# EAGLE design spice-usbm (EAGLE 9.3.0)
CREVISION: hv0a; DESIGNER: Rafael Silva
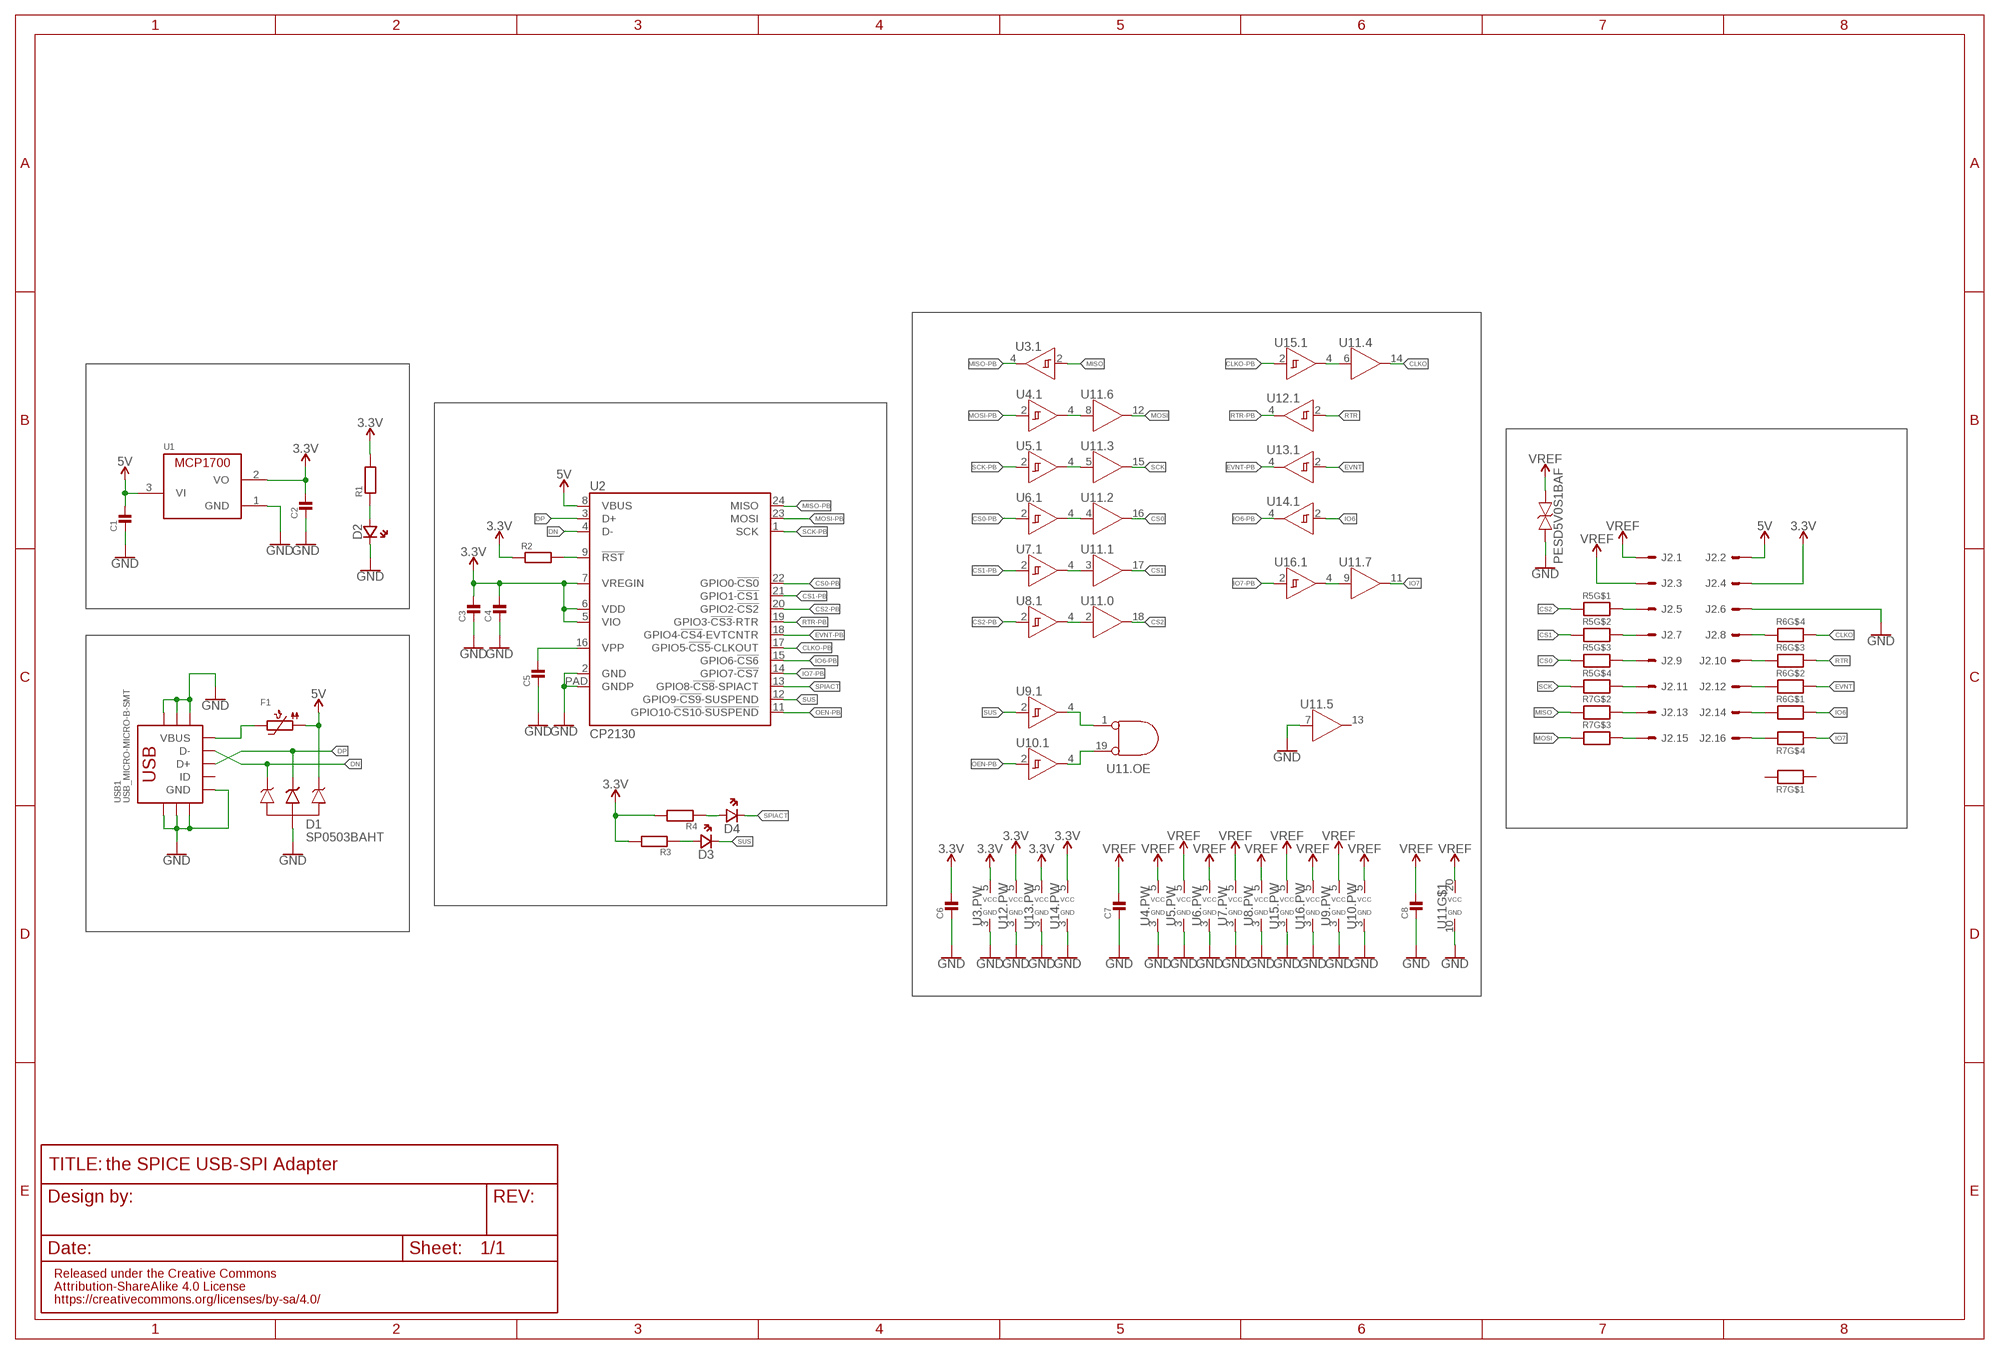
[diagram p0: schematic, sheet 1]

## Parts
C1  MLCC0603  [0603_WAVE]
C2  MLCC0603  [0603_WAVE]
C3  MLCC0603  [0603_WAVE]
C4  MLCC0603  [0603_WAVE]
C5  MLCC0603  [0603_WAVE]
C6  MLCC0603  [0603_WAVE]
C7  MLCC0603  [0603_WAVE]
C8  MLCC0603  [0603_WAVE]
D1  SP0503BAHT  [SOT143]
D2  LED0603  [CHIPLED_0603]
D3  LED0603  [CHIPLED_0603]
D4  LED0603  [CHIPLED_0603]
D5  PESD5V0S1BAF  [SOD323]
F1  PTC1210  [PTC1210]
J2  2X8  [2X8_2.54]
R1  RESISTOR0603  [0603_WAVE]
R2  RESISTOR0603  [0603_WAVE]
R3  RESISTOR0603  [0603_WAVE]
R4  RESISTOR0603  [0603_WAVE]
R5  RESISTOR_4PACK  [RESPACK_4X0603]
R6  RESISTOR_4PACK  [RESPACK_4X0603]
R7  RESISTOR_4PACK  [RESPACK_4X0603]
U1  MCP1700T-3302TT  [SOT-23]
U2  CP2130  [QFN24]
U3  74LVC1G17  [SC70-5]
U4  74LVC1G17  [SC70-5]
U5  74LVC1G17  [SC70-5]
U6  74LVC1G17  [SC70-5]
U7  74LVC1G17  [SC70-5]
U8  74LVC1G17  [SC70-5]
U9  74LVC1G17  [SC70-5]
U10  74LVC1G17  [SC70-5]
U11  74HC541  [TSSOP20]
U12  74LVC1G17  [SC70-5]
U13  74LVC1G17  [SC70-5]
U14  74LVC1G17  [SC70-5]
U15  74LVC1G17  [SC70-5]
U16  74LVC1G17  [SC70-5]
USB1  USB_MICRO-MICRO-B-SMT  [USB-MICRO-SMD]

## Nets
3.3V: C2.P$1 C3.P$1 C4.P$1 C6.P$1 J2.4 R1.P$2 R2.P$1 R3.P$2 R4.P$2 U1.2(VO) U2.5(VIO) U2.6(VDD) U2.7(VREGIN) U3.5(.PW:VCC) U12.5(.PW:VCC) U13.5(.PW:VCC) U14.5(.PW:VCC)
5V: C1.P$1 D1.4 F1.P$1 J2.2 U1.3(VI) U2.8(VBUS)
CLKO: R6.5 U11.14(.4:Y)
CLKO-PB: U2.17(GPIO5-!CS5!-CLKOUT) U15.2(.1:A)
CS0: R5.3 U11.16(.2:Y)
CS0-PB: U2.22(GPIO0-!CS0) U6.2(.1:A)
CS1: R5.2 U11.17(.1:Y)
CS1-PB: U2.21(GPIO1-!CS1) U7.2(.1:A)
CS2: R5.1 U11.18(.0:Y)
CS2-PB: U2.20(GPIO2-!CS2) U8.2(.1:A)
DN: D1.2 U2.4(D-) USB1.D-
DP: D1.3 U2.3(D+) USB1.D+
EVNT: R6.7 U13.2(.1:A)
EVNT-PB: U2.18(GPIO4-!CS4!-EVTCNTR) U13.4(.1:Y)
GND: C1.P$2 C2.P$2 C3.P$2 C4.P$2 C5.P$2 C6.P$2 C7.P$2 C8.P$2 D1.1 D2.C(CA) D5.P$2 J2.6 U1.1(GND) U2.2(GND) U2.PAD(GNDP) U3.3(.PW:GND) U4.3(.PW:GND) U5.3(.PW:GND) U6.3(.PW:GND) U7.3(.PW:GND) U8.3(.PW:GND) U9.3(.PW:GND) U10.3(.PW:GND) U11.7(.5:A) U11.10(GND) U12.3(.PW:GND) U13.3(.PW:GND) U14.3(.PW:GND) U15.3(.PW:GND) U16.3(.PW:GND) USB1.GND USB1.SHIELD1(SHIELD) USB1.SHIELD2(SHIELD) USB1.SHIELD3(SHIELD) USB1.SHIELD4(SHIELD) USB1.SHIELD5(SHIELD) USB1.SHIELD6(SHIELD)
IO6: R6.8 U14.2(.1:A)
IO6-PB: U2.15(GPIO6-!CS6) U14.4(.1:Y)
IO7: R7.4 U11.11(.7:Y)
IO7-PB: U2.14(GPIO7-!CS7) U16.2(.1:A)
MISO: R7.2 U3.2(.1:A)
MISO-PB: U2.24(MISO) U3.4(.1:Y)
MOSI: R7.3 U11.12(.6:Y)
MOSI-PB: U2.23(MOSI) U4.2(.1:A)
N$1: U11.6(.4:A) U15.4(.1:Y)
N$2: D3.A(AN) R3.P$1
N$3: D4.A(AN) R4.P$1
N$4: R2.P$2 U2.9(!RST)
N$5: U5.4(.1:Y) U11.5(.3:A)
N$6: J2.13 R7.7
N$7: U4.4(.1:Y) U11.8(.6:A)
N$8: C5.P$1 U2.16(VPP)
N$9: D2.A(AN) R1.P$1
N$10: U6.4(.1:Y) U11.4(.2:A)
N$11: U7.4(.1:Y) U11.3(.1:A)
N$12: U8.4(.1:Y) U11.2(.0:A)
N$13: F1.P$2 USB1.VBUS
N$14: U11.9(.7:A) U16.4(.1:Y)
N$16: J2.15 R7.6
N$17: J2.5 R5.8
N$18: J2.7 R5.7
N$19: J2.9 R5.6
N$20: J2.11 R5.5
N$21: J2.8 R6.4
N$22: J2.10 R6.3
N$23: J2.12 R6.2
N$24: J2.14 R6.1
N$25: J2.16 R7.5
OE1: U9.4(.1:Y) U11.1(.OE:A)
OE2: U10.4(.1:Y) U11.19(.OE:B)
OEN-PB: U2.11(GPIO10-!CS10!-!SUSPEND) U10.2(.1:A)
RTR: R6.6 U12.2(.1:A)
RTR-PB: U2.19(GPIO3-!CS3!-RTR) U12.4(.1:Y)
SCK: R5.4 U11.15(.3:Y)
SCK-PB: U2.1(SCK) U5.2(.1:A)
SPIACT: D4.C(CA) U2.13(GPIO8-!CS8!-SPIACT)
SUS: D3.C(CA) U2.12(GPIO9-!CS9!-SUSPEND) U9.2(.1:A)
VREF: C7.P$1 C8.P$1 D5.P$1 J2.1 J2.3 U4.5(.PW:VCC) U5.5(.PW:VCC) U6.5(.PW:VCC) U7.5(.PW:VCC) U8.5(.PW:VCC) U9.5(.PW:VCC) U10.5(.PW:VCC) U11.20(VCC) U15.5(.PW:VCC) U16.5(.PW:VCC)
Unconnected: R7.1 R7.8 U11.13(.5:Y) USB1.ID

## Notes on the sheet
- the SPICE USB-SPI Adapter

## Library data of the parts
C1-C8 = Passive Components > Capacitors > Multilayer Ceramic Capacitors MLCC:MLCC: KEMET’s X7R dielectric features a 125°C maximum operating temperature and is considered temperature stable. The Electronics Components, Assemblies and Materials Association (EIA) characterizes X7R dielectric as a Class II material. Components of this classification are fixed, ceramic dielectric capacitors suited for bypass and decoupling applications or for frequency discriminating circuits where Q and stability of capacitance characteristics are not critical. X7R exhibits a predictable change in capacitance with respect to time and voltage, boasting a minimal change in capacitance with reference to ambient temperature. Capacitance change is limited to ±15% from −55°C to +125°C.
D1 = Circuit Protection > ESD Suppressors \ TVS Diodes:SP0503BAHT
D2-D4 = Opto-electronics > LED Emitters:LED: LED 0603 - 0603 Surface Mount Package 2mA: Green LED - Low Power (3.9mcd, 2ma, 1.7Vf) - Digikey: 475-2709-2-ND Orange LED - Low Power (9.8mcd, 2ma, 1.8Vf) - Digikey: 475-1194-2-ND Red LED - Low Power (5mcd, 2ma, 1.8Vf) - Digikey: 475-1195-2-ND Yellow LED - Low Power (7mcd, 2ma, 1.8Vf) - Digikey: 475-1196-2-ND 5mA: Blue LED - Low Power (17mcd, 5ma, 2.9Vf) - Digikey: LNJ937W8CRACT-ND 0805 - 0805 Surface Mount Package 2mA: Red LED (8.8mcd, 2mA, 1.8Vf, Clear) - Low Power [Digikey: 475-2510-1-ND] Green LED (5mcd, 2mA, 1.8Vf, Clear) - Low Power [Digikey: 475-2730-1-ND] Yellow LED (11.3mcd, 2mA, 1.8Vf, Clear) - Low Power [Digikey: 475-2555-1-ND] 20mA: Red LED (104mcd, 20mA, Diffused) - LS R976 [Digikey: 475-1278-6-ND] Red LED (12mcd, 20mA, 2.0Vf, Clear) - APT2012EC [Digikey: 754-1128-1-ND] Green LED (15mcd, 20mA, 2.2Vf, Clear) - APT2012GC [Digikey: 754-1131-1-ND] Orange LED (160mcd, 20mA, 2.1Vf, Clear) - APT2012SECK [Digikey: 754-1130-1-ND] 1206 - 1206 Surface Mount Package Green LED (26mcd, 20mA, Diffused) - LG N971 [Digikey: 475-1407-6-ND] Red LED (15mcd, 20mA, Diffused) - LH N974 [Digikey: 475-1416-6-ND] Cree - Cree High-Power Surface Mount LEDs XPEBWT-L1-0000-00D50 - White 111lm 350mA 2.9Vf 6200K 110° XTEAWT-00-0000-00000LEE3 - White 114lm 350mA 2.85Vf 5000K 115° Everlight - Everlight 45-21 Series Surface Mount LEDs 45-21/QK2C-B2832AC2CB2/2T - Warm White 2000mcd 20mA 3.25Vf 3050K 120° 45-21/LK2C-B38452C4CB2/2T - Nuetral White 2000mcd 20mA 3.25Vf 4150K 120° 45-21/LK2C-B50634C6CB2/2T - Cold White 2200mcd 20mA 3.25Vf 5650K 120° PLCC2 Reverse Mount LS T77K-J1L2-1-0-2-R18-Z - Red 11.25mcd 2mA 1.8Vf 630nm 120° LO T77K-L1M2-24-Z - Orange 19.6mcd 2mA 1.8Vf 606nm 120° LY T77K-K2M1-26-Z - Yellow 15.7mcd 2mA 1.8Vf 587nm 120°
D5 = Circuit Protection > ESD Suppressors \ TVS Diodes:PESD5V0S1BAF: Low capacitance bidirectional ElectroStatic Discharge (ESD) protection diode designed to protect one signal line from the damage caused by ESD and other transients.
F1 = Circuit Protection > Resettable Fuses - PPTC:PTC
J2 = Connectors > Header:2X8
R1-R4 = Passive Components > Resistors > Chip Resistors:RESISTOR: Resistors For new designs, use the packages preceded by an '_' character since they are more reliable: The following footprints should be used on most boards: _0402 - Standard footprint for regular board layouts _0603 - Standard footprint for regular board layouts _0805 - Standard footprint for regular board layouts _1206 - Standard footprint for regular board layouts For extremely tight-pitch boards where space is at a premium, the following 'micro-pitch' footprints can be used (smaller pads, no silkscreen outline, etc.): _0402MP - Micro-pitch footprint for very dense/compact boards _0603MP - Micro-pitch footprint for very dense/compact boards _0805MP - Micro-pitch footprint for very dense/compact boards _1206MP - Micro-pitch footprint for very dense/compact boards
R5-R7 = Passive Components > Resistors > Resistor Networks & Arrays:RESISTOR_4PACK: Resistor Packs (4 resistors) 4 x 0603 10K 1/16W - Digikey: YC164J-10KCT-ND
U1 = Power > LDO Voltage Regulators:MCP1700
U2 = Semiconductors > Integrated Circuits - ICs > Interface ICs > USB Interface IC:CP2130: SINGLE-CHIP USB-TO-SPI BRIDGE
U3-U10 U12-U16 = Semiconductors > Integrated Circuits - ICs > Logic ICs > Logic Gates:74LVC1G17
U11 = Semiconductors > Integrated Circuits - ICs > Logic ICs > Logic Gates:74HC541
USB1 = Connectors > USB:USB_MICRO

## Board
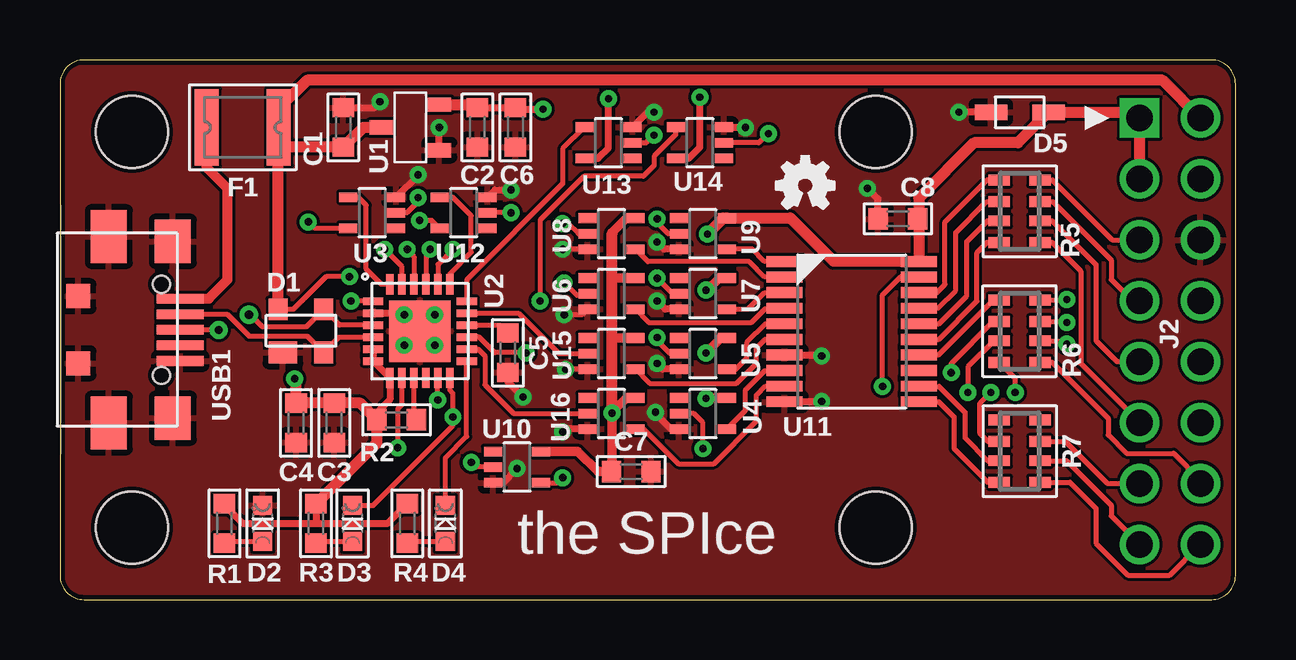
[diagram p1: board, top side]
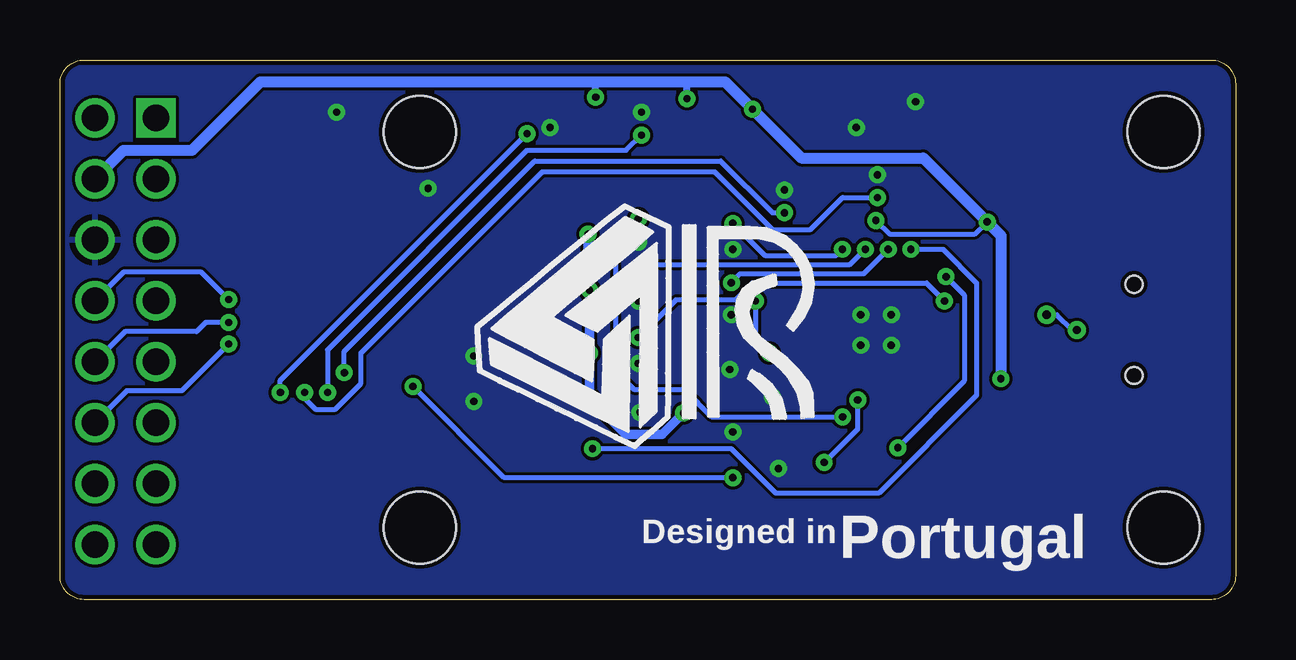
[diagram p2: board, bottom side, seen from below]

Size 49 x 22.5 mm. Coordinates in mm from the lower left corner, seen from the top.
Outline: 0,21.5 0,1 arc90 1,0 48,0 arc90 49,1 49,21.5 arc90 48,22.5 1,22.5 arc90 0,21.5
Copper layers (1*16): Top 0.035mm / dielectric 1.6mm / Bottom 0.035mm
Design rules "jlcpcb-dr": minimum track width 5mil, minimum drill 0.3mm, track to track 5mil, track to pad 5mil, pad to pad 5mil, via to via 5mil, smd to smd 5mil, copper to edge 0.2mm, drill to drill 5mil, minimum pad ring 10mil, minimum via ring 8mil, stop-mask expansion 4mil, vias tented up to drill 0.7mm, thermal gap 10mil
Holes 3 mm at 3,19.5 3,3 34,19.5 34,3

### Footprints (pad centres in the part's own frame; a part is rotated, then mirrored left to right if it is on the bottom)
0603_WAVE = smd 0.8 x 0.9: P$1 -0.823,0; P$2 0.823,0
SOT143 = smd 1.2 x 0.9: 1 -0.711,-0.889 | smd 0.8 x 0.9: 2 0.989,-0.889; 3 0.989,0.911; 4 -0.911,0.911
CHIPLED_0603 = smd 0.8 x 0.8: A 0,-0.75; C 0,0.75
SOD323 = smd 1.35 x 0.65: P$1 -1.2,0; P$2 1.2,0
PTC1210 = smd 1 x 3.2: P$1 -1.5,0; P$2 1.5,0
2X8_2.54 = drill 1.1 square: 1 -8.89,-1.27 | drill 1.1: 2 -8.89,1.27; 3 -6.35,-1.27; 4 -6.35,1.27; 5 -3.81,-1.27; 6 -3.81,1.27; 7 -1.27,-1.27; 8 -1.27,1.27; 9 1.27,-1.27; 10 1.27,1.27; 11 3.81,-1.27; 12 3.81,1.27; 13 6.35,-1.27; 14 6.35,1.27; 15 8.89,-1.27; 16 8.89,1.27
RESPACK_4X0603 = smd 0.45 x 0.9: 1 -1.3,-0.85; 2 -0.4,-0.85; 3 0.4,-0.85; 4 1.3,-0.85; 5 1.3,0.85; 6 0.4,0.85; 7 -0.4,0.85; 8 -1.3,0.85
SOT-23 = smd 0.6 x 1: 1 -0.95,-1.2; 2 0.95,-1.2; 3 0,1.2
QFN24 = smd 0.3 x 0.85: 1 -1.25,-1.95; 2 -0.75,-1.95; 3 -0.25,-1.95; 4 0.25,-1.95; 5 0.75,-1.95; 6 1.25,-1.95; 13 1.25,1.95; 14 0.75,1.95; 15 0.25,1.95; 16 -0.25,1.95; 17 -0.75,1.95; 18 -1.25,1.95 | smd 0.85 x 0.3: 7 1.95,-1.25; 8 1.95,-0.75; 9 1.95,-0.25; 10 1.95,0.25; 11 1.95,0.75; 12 1.95,1.25; 19 -1.95,1.25; 20 -1.95,0.75; 21 -1.95,0.25; 22 -1.95,-0.25; 23 -1.95,-0.75; 24 -1.95,-1.25 | smd 2.55 x 2.55: PAD 0,0
SC70-5 = smd 0.4 x 0.75: 1 -0.65,-1; 2 0,-1; 3 0.65,-1; 4 0.65,1; 5 -0.65,1
TSSOP20 = smd 0.45 x 1.5: 1 -2.91,-2.8; 2 -2.26,-2.8; 3 -1.61,-2.8; 4 -0.96,-2.8; 5 -0.31,-2.8; 6 0.34,-2.8; 7 0.99,-2.8; 8 1.64,-2.8; 9 2.29,-2.8; 10 2.94,-2.8; 11 2.94,2.8; 12 2.29,2.8; 13 1.64,2.8; 14 0.99,2.8; 15 0.34,2.8; 16 -0.31,2.796; 17 -0.96,2.796; 18 -1.61,2.8; 19 -2.26,2.8; 20 -2.91,2.8
USB-MICRO-SMD = smd 1.95 x 0.4: D+ 2.975,0; D- 2.975,0.65; GND 2.975,-1.3; ID 2.975,-0.65; VBUS 2.975,1.3 | smd 1.5 x 2.2: SHIELD1 0,3.885; SHIELD2 0,-3.885 | smd 1.5 x 1.8: SHIELD3 2.667,3.685; SHIELD4 2.667,-3.685 | smd 1 x 1: SHIELD5 -1.27,1.4; SHIELD6 -1.27,-1.4 | hole 0.7: 2.2,1.9; 2.2,-1.9

### Placement (x,y rotation side)
C1  11.81,19.68 90 top
C2  17.4,19.68 270 top
C3  11.43,7.37 270 top
C4  9.84,7.37 270 top
C5  18.67,10.29 270 top
C6  18.99,19.68 270 top
C7  23.81,5.33 0 top
C8  34.92,15.88 180 top
D1  10,11.19 0 top
D2  8.45,3.17 0 top
D3  12.19,3.17 0 top
D4  16.07,3.17 0 top
D5  40.01,20.32 180 top
F1  7.62,19.68 180 top
J2  46.27,11.19 270 top
R1  6.86,3.17 90 top
R2  14.03,7.49 0 top
R3  10.67,3.17 90 top
R4  14.48,3.17 90 top
R5  40,16.19 270 top
R6  40,11.19 90 top
R7  40,6.19 270 top
U1  14.61,19.68 90 top
U2  15,11.19 270 top
U3  13.02,16.13 90 top
U4  26.8,7.76 270 top
U5  26.8,10.26 270 top
U6  22.99,12.76 270 top
U7  26.8,12.76 270 top
U8  22.99,15.26 270 top
U9  26.8,15.26 270 top
U10  19.05,5.52 270 top
U11  33,11.19 270 top
U12  16.83,16.13 90 top
U13  22.86,19.05 90 top
U14  26.67,19.05 90 top
U15  22.99,10.26 270 top
U16  22.99,7.76 270 top
U$1  [DESIGNEDINPT]  17.16,1.72 0 bottom
U$2  [OSHW-LOGO-MINI]  31.06,17.27 0 top
U$4  [RAFAEL_SILVA_10MM_ALT]  31.6,6.4 0 bottom
USB1  2.03,11.25 0 top

### Tracks (layer width: path | path; a pad name or v marks a point on that pad's centre or on a via)
3.3V  (via drill 0.3 pad 0.6)
  Top 0.2: R1.P$2 6.86,3.94 | 17.27,20.64 C2.P$1 | U3.5 10.62,15.48 v10.35,15.75 | U12.5 15.49,15.81 v14.99,15.81
  Top 0.3: 6.86,3.94 7.62,3.17 10.67,3.17 | 10.67,3.17 13.65,3.17 R4.P$2 | R3.P$2 10.67,3.17 | R2.P$1 13.21,7.81 13.75,8.35 U2.7 U2.6 U2.5 | U13.5 22.43,18.4 22.86,18.83 v22.86,20.89 | U14.5 26.21,18.4 26.67,18.86 v26.67,20.95 | C2.P$1 C6.P$1 19.05,20.45 v20.13,20.45
  Top 0.45: R3.P$2 13.21,6.54 R2.P$1 12.51,8.19 C3.P$1 C4.P$1 9.84,9.14 v9.78,9.21 | U1.2 17.27,20.64
  Bottom 0.2: v14.99,15.81 14.41,15.24 10.86,15.24 v10.35,15.75
  Bottom 0.3: v22.86,20.89 22.86,21.59 | v26.67,20.95 26.67,21.59
  Bottom 0.45: v9.78,9.21 9.78,15.18 v10.35,15.75 13.02,18.41 18.1,18.41 v20.13,20.45 21.27,21.59 22.86,21.59 26.67,21.59 40.64,21.59 43.5,18.73 46.35,18.73 J2.4
5V  (via drill 0.3 pad 0.6)
  Top 0.2: U2.8 14.25,8.13 14.08,7.96 v14.08,6.33 | v12.06,13.46 11.09,13.46 9.72,12.1 D1.4 | 9.09,19.65 F1.P$1
  Top 0.45: U1.3 12.63,19.68 C1.P$1 | J2.2 45.97,21.65 10.29,21.65 9.12,20.48 F1.P$1 9.12,19.28 8.89,19.05 9.08,18.86 C1.P$1 | 11.75,18.86 C1.P$1 | D1.4 9.09,19.65
  Bottom 0.2: v14.08,6.33 11.3,9.11 11.3,12.7 v12.06,13.46
CLKO
  Top 0.2: U11.14 36.62,10.2 38.91,12.49 R6.5
CLKO-PB
  Top 0.2: U2.17 19.11,11.94 20.79,10.26 U15.2
CS0
  Top 0.2: U11.16 36.63,11.5 37.79,12.66 37.79,14.93 38.65,15.79 R5.3
CS0-PB  (via drill 0.3 pad 0.6)
  Top 0.2: U6.2 21.92,12.69 21.53,12.69 v21.02,13.21 | v14.48,14.61 14.48,14.57 14.75,14.3 U2.22
  Bottom 0.2: v21.02,13.21 20.64,13.59 15.49,13.59 v14.48,14.61
CS1
  Top 0.2: U11.17 36.6,12.15 37.34,12.89 37.34,15.3 38.62,16.59 R5.2
CS1-PB  (via drill 0.3 pad 0.6)
  Top 0.2: U7.2 25.53,12.76 v24.89,13.4 | v15.43,14.61 15.25,14.43 U2.21
  Bottom 0.2: v24.89,13.4 24.32,13.97 16.07,13.97 v15.43,14.61
CS2
  Top 0.2: U11.18 36.55,12.8 36.89,13.14 36.89,15.75 38.64,17.49 R5.1
CS2-PB  (via drill 0.3 pad 0.6)
  Top 0.2: U8.2 21.61,15.26 21.18,15.68 v20.95,15.68 | v16.38,14.61 15.75,13.97 U2.20
  Bottom 0.2: v20.95,15.68 19.62,14.35 16.64,14.35 v16.38,14.61
DN
  Top 0.2: U2.4 11.63,10.94 D1.2 10.3,10.99 8.51,10.99 7.88,10.99 6.96,11.9 USB1.D-
DP  (via drill 0.35)
  Top 0.152: 7.94,11.87 v7.87,11.87 | v6.61,11.24 v6.6,11.25
  Top 0.2: U2.3 11.65,11.44 D1.3 10.26,11.37 8.45,11.37 7.94,11.87 | v6.6,11.25 USB1.D+
  Bottom 0.2: v7.87,11.87 7.44,11.87 6.8,11.24 v6.61,11.24
EVNT  (via drill 0.3 pad 0.6)
  Top 0.2: R6.7 38.92,10.79 37.85,9.72 v37.85,8.64 | v24.77,19.37 24.75,19.37 24.43,19.05 U13.2
  Bottom 0.2: v24.77,19.37 25.4,18.73 29.53,18.73 37.85,10.41 v37.85,8.64
EVNT-PB
  Top 0.2: U13.4 20.95,18.8 20.95,17.34 16.95,13.33 U2.18
GND  (via drill 0.3 pad 0.6)
  Top 0.2: U8.3 v20.96,14.61 v20.95,14.61 | U6.3 21.75,11.87 v21.02,11.87 | U15.3 21.08,9.61 v21.08,9.59
  Top 0.3: U2.2 14.29,11.94 v14.35,11.87 14.35,11.84 U2.PAD | C5.P$2 18.67,9.08 v19.3,8.45 | U5.3 25.13,9.61 v24.89,9.84 | U7.3 25.23,12.11 v24.89,12.45 | U9.3 25.18,14.61 v24.88,14.91 | U14.3 28.56,19.7 v28.57,19.68 | U13.3 24.48,20.32 v24.77,20.32 | U4.3 25.78,7.09 25.5,7.09 24.83,7.76 v24.83,7.81 | U10.3 18.46,4.88 v19.05,5.46 | 15.59,10.6 v15.62,10.6 | 14.41,10.6 v14.35,10.6 | C1.P$2 13.08,20.51 v13.34,20.77 | U1.1 v15.8,19.68 v15.81,19.68 | U12.3 18.13,17.08 v18.8,17.08 | U3.3 14.92,17.68 v14.92,17.71 | U16.3 21.08,7.11 v20.95,6.99 | U11.10 v31.75,8.26 | U11.7 31.71,10.2 v31.75,10.16 | D5.P$2 v37.47,20.32 | C8.P$2 34.1,16.7 v33.66,17.14
  other vias: 15.62,11.87
  pour Bottom: 0,22.54 48.96,22.54 48.96,0 0,0
  pour Top: 48.96,0 0,0 0,22.54 48.96,22.54
IO6  (via drill 0.3 pad 0.6)
  Top 0.2: 39.04,9.89 R6.8 39.81,9.23 v39.81,8.64 | v29.53,19.43 29.51,19.43 29.13,19.05 U14.2
  Bottom 0.2: v39.81,8.64 39.81,9.14 v29.53,19.43
IO6-PB  (via drill 0.3 pad 0.6)
  Top 0.2: U14.4 25.66,19.38 24.77,18.48 24.77,18.1 24.32,17.65 21.84,17.65 20.01,15.82 v20.01,12.45 | v19.43,10.29 18.12,10.29 17.48,10.94 U2.15
  Bottom 0.2: v20.01,12.45 20.01,10.87 v19.43,10.29
IO7
  Top 0.2: U11.11 36.63,8.25 37.26,7.62 37.26,6.3 38.67,4.89 R7.4
IO7-PB
  Top 0.2: U2.14 17.44,10.44 17.72,10.16 17.72,8.95 18.91,7.76 U16.2
MISO  (via drill 0.3 pad 0.6)
  Top 0.2: R7.2 38.69,6.59 38.35,6.92 38.35,8.19 v38.8,8.64 | U3.2 14.46,16.13 14.92,16.59 v14.92,16.76
  Bottom 0.2: v38.8,8.64 38.73,8.57 38.73,8.32 38.35,7.94 37.53,7.94 36.45,9.02 36.45,10.29 28.89,17.84 21.72,17.84 19.3,15.43 17.72,15.43 16.38,16.76 v14.92,16.76
MISO-PB
  Top 0.2: U3.4 12.43,16.78 12.76,16.45 12.76,13.78 13.4,13.14 U2.24
MOSI
  Top 0.2: U11.12 36.64,8.89 37.72,7.81 37.72,6.73 38.66,5.79 R7.3
MOSI-PB  (via drill 0.3 pad 0.6)
  Top 0.2: U2.23 14.25,13.88 v13.53,14.61 | v26.8,6.29 26.8,7.38 26.42,7.76 U4.2
  Bottom 0.2: v13.53,14.61 12.19,14.61 10.79,13.21 10.79,8.51 14.87,4.44 19.16,4.44 21.02,6.29 v26.8,6.29
N$1
  Top 0.2: U15.4 24.58,9.02 28.19,9.02 29.03,9.85 29.03,10.49 29.39,10.85 U11.6
N$2
  Top 0.2: R3.P$1 10.74,2.42 D3.A
N$3
  Top 0.2: R4.P$1 14.55,2.42 D4.A
N$4
  Top 0.2: R2.P$2 14.73,7.62 14.73,9.22 U2.9
N$5
  Top 0.2: U5.4 28.18,9.61 28.62,10.05 28.62,10.72 29.41,11.5 U11.5
N$6
  Top 0.2: R7.7 41.92,6.59 43.67,4.84 J2.13
N$7
  Top 0.2: U4.4 28.57,7.89 28.57,8.74 29.38,9.55 U11.8
N$8
  Top 0.2: U2.16 18.34,11.44 C5.P$1
N$9
  Top 0.2: R1.P$1 6.93,2.42 D2.A
N$10
  Top 0.2: U6.4 24.54,11.56 28.83,11.56 29.4,12.13 30.18,12.13 U11.4
N$11
  Top 0.2: U7.4 28.68,12.11 29.37,12.8 U11.3
N$12
  Top 0.2: U11.2 29.38,13.45 28.74,14.09 24.51,14.09 U8.4
N$13
  Top 0.406: USB1.VBUS 6.2,12.55 6.99,13.34 6.99,17.14 6.12,18.01 F1.P$2
  Top 0.45: 6.12,18.82 F1.P$2
N$14
  Top 0.2: U16.4 24.33,7.11 25.77,5.67 27.25,5.67 29.03,7.44 29.03,8.52 29.41,8.9 U11.9
N$16
  Top 0.2: R7.6 41.96,5.79 43.81,3.94 43.81,3.48 J2.15
N$17
  Top 0.2: R5.8 41.37,17.49 43.86,15 J2.5
N$18
  Top 0.2: R5.7 41.39,16.59 43.81,14.16 43.81,13.34 44.69,12.46 J2.7
N$19
  Top 0.2: J2.9 44.05,9.92 43.18,10.79 43.18,13.97 41.36,15.79 R5.6
N$20
  Top 0.2: R5.5 41.36,14.89 42.55,13.7 42.55,9.84 J2.11
N$21  (via drill 0.3 pad 0.6)
  Top 0.2: R6.4 41.95,12.49 v41.97,12.51
  Bottom 0.2: v41.97,12.51 43.11,13.65 46.35,13.65 J2.8
N$22  (via drill 0.3 pad 0.6)
  Top 0.2: R6.3 41.93,11.59 v41.97,11.56
  Bottom 0.2: v41.97,11.56 42.93,11.56 43.31,11.18 46.28,11.18 J2.10
N$23  (via drill 0.3 pad 0.6)
  Top 0.2: R6.2 41.84,10.79 v41.97,10.66
  Bottom 0.2: v41.97,10.66 43.92,8.7 46.22,8.7 J2.12
N$24
  Top 0.2: J2.14 47.54,4.97 46.42,6.1 44.45,6.1 43.69,6.86 43.69,7.56 41.35,9.89 R6.1
N$25
  Top 0.2: R7.5 42.1,4.89 43.18,3.81 43.18,2.35 44.51,1.02 46.26,1.02 J2.16
OE1
  Top 0.2: U11.1 29.38,14.1 28.87,14.61 U9.4
OE2  (via drill 0.3 pad 0.6)
  Top 0.2: U10.4 20.75,4.88 v20.95,5.08 | v34.29,8.89 34.29,12.7 35.04,13.45 U11.19
  Bottom 0.2: v20.95,5.08 30.48,5.08 v34.29,8.89
OEN-PB  (via drill 0.3 pad 0.6)
  Top 0.2: 17.78,5.52 U10.2 17.34,5.52 v17.14,5.71 | v15.75,8.32 U2.11
  Bottom 0.2: v17.14,5.71 15.75,7.11 v15.75,8.32
RTR  (via drill 0.3 pad 0.6)
  Top 0.2: R6.6 38.9,11.59 37.15,9.84 v37.15,9.46 | v18.8,16.13 U12.2
  Bottom 0.2: v37.15,9.46 37.15,10.35 29.21,18.29 21.46,18.29 19.3,16.13 v18.8,16.13
RTR-PB
  Top 0.2: U2.19 16.25,13.58 17.14,14.48 17.14,16 16.37,16.78 U12.4
SCK
  Top 0.2: U11.15 36.63,10.85 38.23,12.45 38.23,14.47 38.64,14.89 R5.4
SCK-PB  (via drill 0.3 pad 0.6)
  Top 0.2: U2.1 v12.13,12.44 v12.13,12.45 | v24.89,10.92 24.89,10.79 25.43,10.26 U5.2
  Bottom 0.2: v24.89,10.92 23.3,12.51 20.83,12.51 20.14,13.2 12.88,13.2 v12.13,12.45
SPIACT
  Top 0.2: D4.C 16.07,5.91 16.95,6.79 U2.13
SUS  (via drill 0.3 pad 0.6)
  Top 0.2: 16.38,7.62 16.38,7.26 13.04,3.92 D3.C | 16.38,7.62 16.38,8.6 16.25,8.73 U2.12 | v24.89,15.88 24.89,15.72 25.35,15.26 U9.2 | v16.37,7.62 16.38,7.62
  Bottom 0.2: v24.89,15.88 25.84,14.92 25.84,9.53 25.08,8.76 22.98,8.76 21.84,7.62 v16.37,7.62
VREF  (via drill 0.3 pad 0.6)
  Top 0.152: 24.02,15.88 U8.5 23.97,15.91 | v26.93,12.9 v26.92,12.89 | 23.79,8.41 U16.5 | v23.01,7.77 22.99,7.75
  Top 0.2: 23.01,15.26 22.99,15.29
  Top 0.4: v26.92,8.38 26.95,8.41 U4.5 | U7.5 27.48,13.41 26.97,12.9 v26.93,12.9 26.93,12.96 | U16.5 23.61,8.41 23.01,7.81 v23.01,7.77 23.01,5.36 C7.P$1 22.42,5.33 21.58,6.17 U10.5 | C8.P$1 35.8,15.88 | U8.5 23.61,15.91 22.99,15.29 | v26.92,10.29 27.54,10.91 U5.5 | U15.5 23.12,10.91 23.01,10.79 | U6.5 23.09,13.41 23.01,13.34
  Top 0.45: J2.3 J2.1 44.76,20.32 D5.P$1 39.94,19.05 38.1,19.05 35.8,16.75 35.8,15.88 U11.20 32.26,14.1 30.45,15.91 U9.5 27.66,15.91 v26.99,15.24 | v23.01,7.77 23.01,10.79 23.01,13.34 23.01,15.26
  Bottom 0.2: 23,7.78 v23.01,7.77
  Bottom 0.4: v26.99,15.24 26.99,12.95 v26.93,12.9 26.93,10.3 v26.92,10.29 v26.92,8.38 25.43,6.88 23.9,6.88 v23.01,7.77

### Text on the board
tPlace: the SPIce
_tPlace: U13 | U14 | U8 | U9 | U3 | U12 | D1 | U6 | U7 | U2 | J2 | U15 | U5 | U16 | U4 | U10
_tNames: C1 | D5 | U1 | C2 | C6 | F1 | C8 | R5 | C5 | R6 | USB1 | C7 | U11 | R2 | R7 | C4 | C3 | R1 | D2 | R3 | D3 | R4 | D4